# Altium schematic sheet Station sheet1.SchDoc
size A4; SheetNumber: 1; SheetTotal: 2
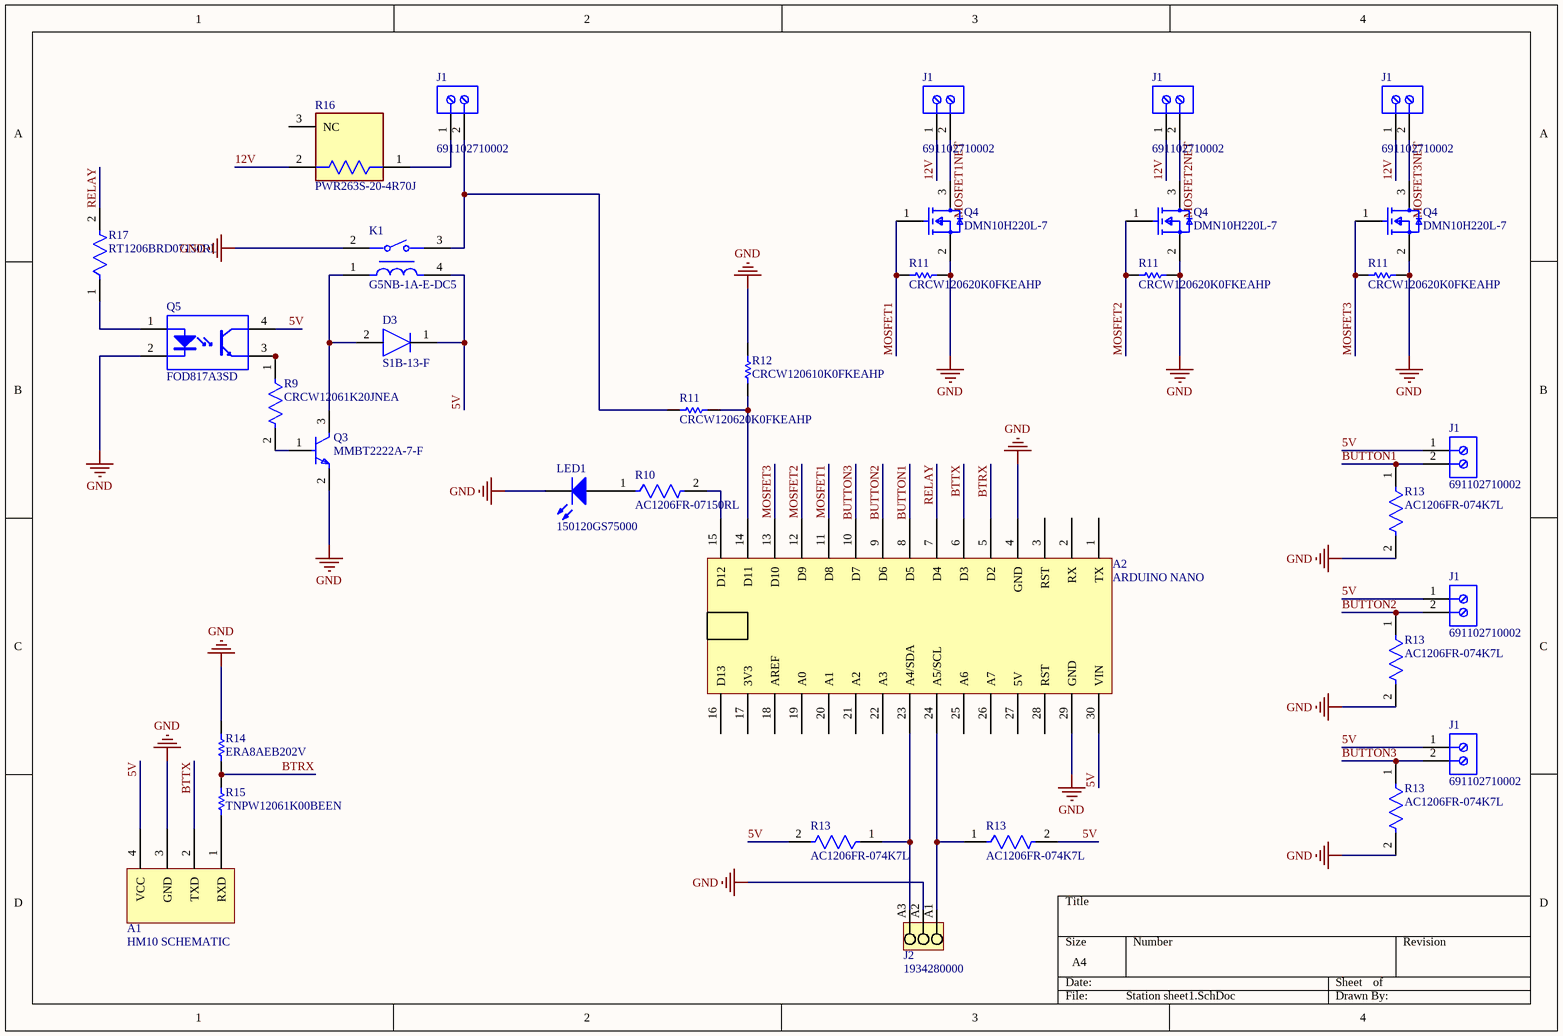
[diagram p0: Station sheet1.SchDoc]

## Parts
(Parts that share a designator on the sheet are numbered #1, #2 ... from top to bottom, then left to right.)
A1  HM10 SCHEMATIC  [HM10]
A2  ARDUINO NANO  [ARDUINO NANO]
D3  S1B-13-F  [FP-SMA-MFG]
J1#1  691102710002  [691102710002]
J1#2  691102710002  [691102710002]
J1#3  691102710002  [691102710002]
J1#4  691102710002  [691102710002]
J1#5  691102710002  [691102710002]
J1#6  691102710002  [691102710002]
J1#7  691102710002  [691102710002]
J2  1934280000  [LL_5_00_90_03]
K1  G5NB-1A-E-DC5  [FP-G5NB-1A-E-DC5-MFG]
LED1  150120GS75000  [1206_A]
Q3  MMBT2222A-7-F  [FP-SOT23-IPC_A]
Q4#1  DMN10H220L-7  [FP-SOT23-MFG]
Q4#2  DMN10H220L-7  [FP-SOT23-MFG]
Q4#3  DMN10H220L-7  [FP-SOT23-MFG]
Q5  FOD817A3SD  [FAIR-SMT-4_V]
R9  CRCW12061K20JNEA  [FP-CRCW1206-e3-MFG]
R10  AC1206FR-07150RL  [FP-AC1206-MFG]
R11#1  CRCW120620K0FKEAHP  [RESC3116X65X50LL20T20]
R11#2  CRCW120620K0FKEAHP  [RESC3116X65X50LL20T20]
R11#3  CRCW120620K0FKEAHP  [RESC3116X65X50LL20T20]
R11#4  CRCW120620K0FKEAHP  [RESC3116X65X50LL20T20]
R12  CRCW120610K0FKEAHP  [RESC3116X65X50NL20T20]
R13#1  AC1206FR-074K7L  [FP-AC1206-MFG]
R13#2  AC1206FR-074K7L  [FP-AC1206-MFG]
R13#3  AC1206FR-074K7L  [FP-AC1206-MFG]
R13#4  AC1206FR-074K7L  [FP-AC1206-MFG]
R13#5  AC1206FR-074K7L  [FP-AC1206-MFG]
R14  ERA8AEB202V  [RESC3216X70X50ML20T25]
R15  TNPW12061K00BEEN  [RESC3216X65X50ML15T25]
R16  PWR263S-20-4R70J  [FP-PWR263S-20-MFG]
R17  RT1206BRD07150RL  [FP-RT1206-MFG]

## Nets
GND: A1.3(GND) A2.4(GND) A2.29(GND) J2.A2 K1.2 LED1.1(K) Q3.2(E) Q4#1.2(S) Q4#2.2(S) Q4#3.2(S) Q5.2(CATHODE) R11#1.2 R11#2.2 R11#3.2 R12.2 R13#1.2 R13#2.2 R13#3.2 R14.2
5V: A1.4(VCC) A2.30(VIN) D3.1(C) J1#5.1 J1#6.1 J1#7.1 K1.4 Q5.4(COLLECTOR) R13#4.2 R13#5.2
12V: J1#2.1 J1#3.1 J1#4.1 R16.2
BTRX: A2.5(D2) R14.1 R15.2
BTTX: A1.2(TXD) A2.6(D3)
BUTTON1: A2.8(D5) J1#5.2 R13#1.1
BUTTON2: A2.9(D6) J1#6.2 R13#2.1
BUTTON3: A2.10(D7) J1#7.2 R13#3.1
MOSFET1: A2.11(D8) Q4#1.1(G) R11#1.1
MOSFET1NET: J1#2.2 Q4#1.3(D)
MOSFET2: A2.12(D9) Q4#2.1(G) R11#2.1
MOSFET2NET: J1#3.2 Q4#2.3(D)
MOSFET3: A2.13(D10) Q4#3.1(G) R11#3.1
MOSFET3NET: J1#4.2 Q4#3.3(D)
RELAY: A2.7(D4) R17.2
NetA1_1: A1.1(RXD) R15.1
NetA2_14: A2.14(D11) R11#4.2 R12.1
NetA2_15: A2.15(D12) R10.2
NetA2_23: A2.23(A4/SDA) J2.A3 R13#4.1
NetA2_24: A2.24(A5/SCL) J2.A1 R13#5.1
NetD3_2: D3.2(A) K1.1 Q3.3(C)
NetJ1#1_1: J1#1.1 R16.1
NetJ1#1_2: J1#1.2 K1.3 R11#4.1
NetLED1_2: LED1.2(A) R10.1
NetQ3_1: Q3.1(B) R9.2
NetQ5_1: Q5.1(ANODE) R17.1
NetQ5_3: Q5.3(EMITTER) R9.1

Not connected (* = marked no-connect by the designer): A2 1(TX) 2(RX) 3(RST) 16(D13) 17(3V3) 18(AREF) 19(A0) 20(A1) 21(A2) 22(A3) 25(A6) 26(A7) 27(5V) 28(RST); R16 3(NC)

## Library data of the parts
D3 = CMP-12791-000051-1: DIODE GEN PURP 100V 1A SMA; Peak Non-Repetitive Surge Current: 30A; Element Configuration: Single; Recovery Time: 1.8us; Peak Reverse Current: 5uA; Forward Voltage: 1.1V; Capacitance: 10pF; Polarity: Standard; Reverse Recovery Time: 3us; Output Current: 1A; Width: 2.92mm; Current Rating: 1A; Max Surge Current: 30A; Length: 4.6mm; Contact Plating: Tin; Radiation Hardening: No; Max Repetitive Reverse Voltage (Vrrm): 100V; Min Operating Temperature: -65°C; Forward Current: 1A; Lead Free: Lead Free; Weight: 0.002258oz; Mount: Surface Mount; Number of Pins: 2; Packaging: Tape and Reel; Reverse Voltage (DC): 100V; Max Operating Temperature: 150°C; Termination: SMD/SMT; Max Reverse Voltage (DC): 100V; Voltage Rating (DC): 100V; Package Quantity: 5000; Average Rectified Current: 1A; Height: 2.1mm; Case/Package: SMA
J1#1-J1#7 = CMP-1502-03258-1: Series 102 - 5.00 mm Horizontal Entry Modular with Pressure Clamp WR-TBL, 2 pin; Manufacturer: Wurth Elektronik; Pin Number: 2; Pitch: 5.00mm; Manufacturer URL: http://www.we-online.de; Mounting Technology: THT; Publisher: WurthElektronik; Packaging: Box; Package Reference: 691102710002; Datasheet URL: http://katalog.we-online.de/em/datasheet/6911027100xx.pdf; Operating Temperature: -40to105degC; Part Number: 691102710002
J2 = CMP-1559-01665-1: OMNIMATE Signal - series LL; Manufacturer: Weidmueller; Pitch_mm: 5 mm; Contact_surface: tinned; Wire_cross_section_AWG_max_UL_1059: AWG 12; Insulating_material: Wemid (PA); Rated_voltage_use_group_B_UL_1059: 300 V; Solid_max_H05_07_V_U: 6 mm²; Rated_voltage_for_surge_voltage_class_pollution_degree_II_2: 500 V; No_of_poles: 3; UL_94_flammability_rating: V-0; Mounting_onto_the_PCB: Solder connection; Rated_current_use_group_B_UL_1059: 20 A; Wire_cross_section_AWG_min_UL_1059: AWG 28; Solid_min_H05_07_V_U: 0,5 mm²; Side_termination_characteristic: closed side; Contact_material: Cu-Leg; Short_text_for_material: LL 5.00/03/90 3.2SN OR BX; Pitch_inch: 0,197 inch; Solder_pin_length_mm: 3,2 mm; Qty: 100 PCS; PartNumber: 1934280000; ComponentLink2URL: http://catalog.weidmueller.com/catalog/Start.do?localeId=en&ObjectID=1934280000; PackageReference: LL_5_00_90_03; Packaging: Box; ComponentLink2Description: URL Link1; Revision: V1; ComponentLink1Description: Manufacturer URL; ComponentLink1URL: http://www.weidmueller.com/; Colour: Orange
K1 = CMP-08822-000168-1: RELAY GENERAL PURPOSE SPST 5A 5V; Max Voltage Rating (AC): 250V; Release Time: 10ms; Coil Power: 200mW; Coil Resistance: 125R; Coil Current: 40mA; Max Voltage Rating (DC): 30V; Coil Type: Non-Latching; Coil Voltage (DC): 5V; Weight: 4g; Throw Configuration: SPST; Package Quantity: 100; Max Operating Temperature: 70°C; Min Operating Temperature: -40°C; Mount: Through Hole; Number of Pins: 4; Operate Time: 10ms; Packaging: Bulk; Relay Type: General Purpose; Contact Current Rating: 5A; Termination: PC Pin
LED1 = CMP-1426-00014-1: SMD mono-color Chip LED, WL-SMCW, Green; Manufacturer: Wuerth Elektronik; PackageReference: 1206_A; PartNumber: 150120GS75000; ComponentLink1Description: Manufacturer URL; ComponentLink2URL: http://katalog.we-online.com/led/datasheet/150120GS75000.pdf; ComponentLink2Description: Datasheet; Color: Green; ComponentLink1URL: http://www.we-online.com
Q3 = CMP-1693-00003-4: TRANS NPN 40V 0.6A SMD SOT23-3; Number of Elements: 1; Frequency: 300MHz; Max Collector Current: 600mA; Collector Base Voltage (VCBO): 75V; Current: 1A; Element Configuration: Single; Power Dissipation: 350mW; hFE Min: 100; Collector Emitter Saturation Voltage: 1V; Max Power Dissipation: 300mW; Emitter Base Voltage (VEBO): 6V; Voltage: 40V; Collector Emitter Breakdown Voltage: 40V; Width: 1.4mm; Polarity: NPN; Termination: SMD/SMT; Max Operating Temperature: 150°C; Transition Frequency: 300MHz; Contact Plating: Tin; Mount: Surface Mount; Max Frequency: 300MHz; Case/Package: SOT-23; Gain Bandwidth Product: 300MHz; Lead Free: Lead Free; Collector Emitter Voltage (VCEO): 40V; Radiation Hardening: No; Voltage Rating (DC): 40V; Height: 1mm; Max Breakdown Voltage: 40V; Packaging: Tape and Reel; Length: 3.05mm; Min Operating Temperature: -55°C; Weight: 0.000282oz; Current Rating: 600mA; REACH SVHC: No SVHC; Package Quantity: 3000; Continuous Collector Current: 600mA; Number of Pins: 3
Q4#1-Q4#3 = CMP-12801-000027-1: MOSFET N-CH 100V 1.6A SOT-23; Manufacturer: Diodes Inc.; Typ Forward Diode Voltage: 0.7V; Max Junction Temp: +150°C; Reverse Recovery Charge: 9.8nC; Gate Charge At Vgs: 8.3nC @ 10V; Turn Off Delay Time: 7.9ns; Depletion Mode: False; Power Dissipation: 1.3W; Rthja Max: 177°C/W; Reverse Recovery Time: 17ns; Gate To Source Voltage: 16V; Drain To Source Resistance: 250mΩ; Threshold Vgs Max: 2.5V; Turn On Delay Time: 6.8ns; Threshold Vgs Min: 1V; Pulse Drain Current: 8A; Number Of Channels: 1; Max Forward Diode Voltage: 1.2V; Standoff Height: 0.013mm; Input Capacitace At Vds: 401pF @ 25V; Continuous Drain Current: 1.4A; Manufacturer Part Number: DMN10H220L-7; Device Class L2: Transistors; Automotive: No; Device Class L3: MOSFETs; Drain To Source Breakdown Voltage: 100V; Footprint Url: https://www.diodes.com/assets/Package-Files/SOT23.pdf; Package: SOT23; Lead Free: Yes; Temperature: -55°C to +150°C; Drain To Source Voltage: 100V; Device Class L1: Discrete Semiconductors; ComponentLink2URL: https://www.diodes.com/assets/Datasheets/DMN10H220L.pdf; Temperature Range High: +150°C; Temperature Range Low: -55°C; Category: Trans; Mouser Description: DMN10H220L Series 100 V 250 mOhm N-Channel Enhancement Mode Mosfet - SOT-23; RoHS: TRUE; ComponentLink2Description: Datasheet; Height: 1.1mm; Digikey Description: MOSFET N-CH 100V 1.6A SOT-23; Octopart: https://octopart.com/dmn10h220l-7-diodes+inc.-38898610; Number Of N Channels: 1
Q5 = CMP-2000-06278-1: Phototransistor Optocoupler, 1.2 V, -55 to 110 degC, 4-Pin SMT, RoHS, Tape and Reel; Manufacturer: Fairchild Semiconductor; Reverse Breakdown Voltage: 6V; Forward Current: 50mA; Rise Time: 18000ns; Isolation Voltage: 5000V; Number of  Elements: 1; Power Dissipation: 0.2W; Collector-Emitter Voltage: 70V; Collector Current (DC) (Max): 0.05A; Current Transfer Ratio: 160%; DELETED: Compliant; Collector-Emitter Saturation Voltage: 0.2V; Output Type: DC; Rad Hardened: No; Forward Voltage: 1.4V; Datasheet URL: https://www.fairchildsemi.com/datasheets/FO/FOD814A.pdf; Package Reference: SMT-4; Package URL: https://www.fairchildsemi.com/package-drawings/N0/N04C.pdf; Pin Count: 4; Collector Current (DC): 0.05A; Datasheet Version: Rev. 2.8, 11/2015; Mounting: SurfaceMount; Package Description: 4-Pin Surface Mount Device, Body 6.5 x 4.6 mm, Pitch 2.54 mm; Packaging: TapeandReel; Fall Time: 18000ns; Operating Temperature Classification: Industrial; Manufacturer URL: https://www.fairchildsemi.com/; Input Type: DC; Operating Temp Range: -55Cto110C; Output Device: Transistor; Package Type: PDIP-BSMD; Mounting Technology: SurfaceMount
R9 = CMP-2003-01877-2: RES Thick Film, 1.2kΩ, 5%, 0.25W, 200ppm/°C, 1206; Voltage Rating (DC): 200V; Max Power Dissipation: 250mW; Resistance: 1.2kR; Features: Automotive AEC-Q200; Termination: SMD/SMT; Min Operating Temperature: -55°C; Tolerance: 5%; Height: 0.024inch; Depth: 1.6mm; Radiation Hardening: No; Package Quantity: 1; Temperature Coefficient: 200ppm/°C; Weight: 0.000353oz; Military Standard: Not; Max Operating Temperature: 155°C; Contact Plating: Tin; Case Code (Metric): 3216; Packaging: Tape and Reel; Lead Free: Lead Free; Composition: Thick Film; Case Code (Imperial): 1206; Case/Package: 1206; Number of Terminations: 2; Voltage Rating: 200V; Length: 3.2mm; Width: 1.6mm; Power Rating: 250mW
R10 = CMP-2003-04913-2: RES SMD 150 OHM 1% 1/4W 1206; Manufacturer: Yageo; Voltage Rating: 200V; Power Rating: 0.25W; Resistance: 150Ω; Automotive Grade: Grade 0; Tolerance: 0.01; Value: 150Ω; Category: Res; Series: AC; Composition: Thick Film; Mouser Description: Thick Film Resistors 150ohm 1% 1/4W AEC-Q200; Temperature: -55°C to +155°C; Temperature Range High: +155°C; Device Class L1: Passive Components; Device Class L2: Resistors; Digikey Description: RES SMD 150 OHM 1% 1/4W 1206; Manufacturer Part Number: AC1206FR-07150RL; Ipc Land Pattern Name: RESC310160X55; Package: AC1206; Device Class L3: Chip SMD Resistors; Octopart: https://octopart.com/ac1206fr-07150rl-yageo-21711118; ComponentLink2URL: http://www.yageo.com/NewPortal/yageodocoutput?fileName=/pdf/R-Chip/PYu-AC_51_RoHS_L_6.pdf; Height: 0.65mm; Lead Free: Yes; RoHS: TRUE; Footprint Url: http://www.yageo.com/exep/pages/download/literatures/PYu-R_Mount_10.pdf; Temperature Range Low: -55°C; Automotive: Yes; ComponentLink2Description: Datasheet
R11#1-R11#4 = CMP-2003-04875-1: Manufacturer: Vishay Dale; Part Number: CRCW120620K0FKEAHP
R12 = CMP-2003-04883-1: Manufacturer: Vishay Dale; Part Number: CRCW120610K0FKEAHP
R13#1-R13#5 = CMP-2003-04896-2: RES SMD 4.7K OHM 1% 1/4W 1206; Manufacturer: Yageo; Value: 4.7KΩ; Tolerance: 0.01; Automotive Grade: Grade 0; Power Rating: 0.25W; Voltage Rating: 200V; Mouser Description: Thick Film Resistors - SMD 1/4W 4.7K ohm 1% AEC-Q200; Footprint Url: http://www.yageo.com/exep/pages/download/literatures/PYu-R_Mount_10.pdf; Resistance: 4.7KΩ; Height: 0.65mm; Temperature: -55°C to +155°C; Category: Res; ComponentLink2Description: Datasheet; Series: AC; Device Class L2: Resistors; Device Class L1: Passive Components; RoHS: TRUE; Digikey Description: RES SMD 4.7K OHM 1% 1/4W 1206; Manufacturer Part Number: AC1206FR-074K7L; Device Class L3: Chip SMD Resistors; Octopart: https://octopart.com/ac1206fr-074k7l-yageo-25629454; Temperature Range Low: -55°C; Ipc Land Pattern Name: RESC310160X55; Temperature Range High: +155°C; Composition: Thick Film; ComponentLink2URL: http://www.yageo.com/NewPortal/yageodocoutput?fileName=/pdf/R-Chip/PYu-AC_51_RoHS_L_6.pdf; Automotive: Yes; Lead Free: Yes; Package: AC1206
R14 = CMP-2003-04435-1: Manufacturer: Panasonic; Part Number: ERA8AEB202V
R15 = CMP-2003-04643-1: Manufacturer: Vishay Dale; Part Number: TNPW12061K00BEEN
R16 = CMP-07231-000013-1: RES SMD 4.7 OHM 5% 20W D2PAK; Manufacturer: Bourns Inc.; Temperature Coefficient: 100ppm/°C; Automotive Grade: Grade 0; Resistance: 4.7Ω; Value: 4.7Ω; Voltage Rating: 250V; Height: 4.88mm; Manufacturer Part Number: PWR263S-20-4R70J; ComponentLink2Description: Datasheet; Automotive: Yes; ComponentLink2URL: https://www.bourns.com/docs/Product-Datasheets/PWR263S-20.pdf; Temperature Range High: +155°C; Device Class L3: Chip SMD Resistors; Tolerance: 5%; Octopart: https://octopart.com/pwr263s-20-4r70j-bourns-10527647; Temperature: -55°C to +155°C; Lead Free: Yes; Series: PWR263S-20; Power Rating: 20W; Mouser Description: Thick Film Resistors 4.7ohms 5% 20watts; Temperature Range Low: -55°C; Package: PWR263S-20; Device Class L1: Passive Components; Digikey Description: RES SMD 4.7 OHM 5% 20W D2PAK; Composition: Thick Film; Device Class L2: Resistors; RoHS: TRUE; Category: Res
R17 = CMP-2003-04280-2: RES SMD 150 OHM 0.1% 1/4W 1206; Manufacturer: Yageo; Power Rating: 0.25W; Temperature Coefficient: 25 ppm/°C; Resistance: 150Ω; Tolerance: 0.005; Value: 150Ω; Voltage Rating: 200V; Digikey Description: RES SMD 150 OHM 0.1% 1/4W 1206; Octopart: https://octopart.com/rt1206brd07150rl-yageo-1430859; Footprint Url: http://www.yageo.com/exep/pages/download/literatures/PYu-R_Mount_10.pdf; ComponentLink2URL: http://www.yageo.com/documents/recent/PYu-RT_1-to-0.01_RoHS_L_9.pdf; Device Class L3: Chip SMD Resistors; Height: 0.65mm; Device Class L1: Passive Components; Temperature: -55°C to +155°C; Temperature Range High: +155°C; Composition: Thin Film; Automotive: No; Mouser Description: Res Thin Film 1206 150 Ohm 0.1% 1/4W ±25ppm/°C Molded SMD Paper T/R; Manufacturer Part Number: RT1206BRD07150RL; RoHS: TRUE; Package: RT1206; Lead Free: Yes; ComponentLink2Description: Datasheet; Temperature Range Low: -55°C; Ipc Land Pattern Name: RESC310160X55; Series: RT; Device Class L2: Resistors; Category: Res